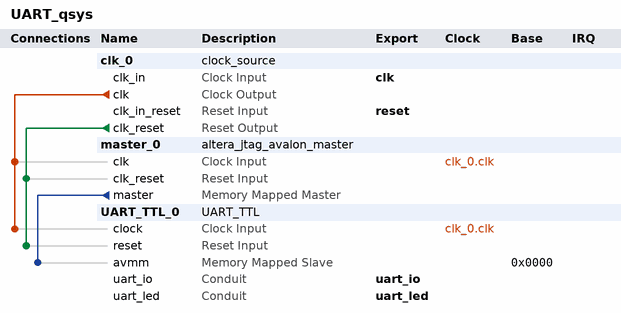
[diagram p0: system contents]
# Platform Designer (Qsys) system UART_qsys, Cyclone II EP2C8Q208C8
# Parameters at their usual value, and those the tool derives, are not listed.
package require -exact qsys 13.0
create_system UART_qsys
set_project_property DEVICE_FAMILY {Cyclone II}
set_project_property DEVICE EP2C8Q208C8

add_instance clk_0 clock_source 13.0
set_instance_parameter_value clk_0 clockFrequency 50000000

add_instance master_0 altera_jtag_avalon_master 13.0

add_instance UART_TTL_0 UART_TTL 1.1
set_instance_parameter_value UART_TTL_0 baudrate 115200
set_instance_parameter_value UART_TTL_0 dataBits 8
set_instance_parameter_value UART_TTL_0 stopBits 1

# connections
add_connection clk_0.clk master_0.clk clock
add_connection clk_0.clk UART_TTL_0.clock clock
add_connection clk_0.clk_reset master_0.clk_reset reset
add_connection clk_0.clk_reset UART_TTL_0.reset reset
add_connection master_0.master UART_TTL_0.avmm avalon
set_connection_parameter_value master_0.master/UART_TTL_0.avmm baseAddress 0x0000

# exported interfaces
add_interface clk clock sink
set_interface_property clk EXPORT_OF clk_0.clk_in
add_interface reset reset sink
set_interface_property reset EXPORT_OF clk_0.clk_in_reset
add_interface uart_io conduit end
set_interface_property uart_io EXPORT_OF UART_TTL_0.uart_io
add_interface uart_led conduit end
set_interface_property uart_led EXPORT_OF UART_TTL_0.uart_led

set_interconnect_requirement {$system} qsys_mm.clockCrossingAdapter HANDSHAKE
set_interconnect_requirement {$system} qsys_mm.maxAdditionalLatency 1

save_system UART_qsys.qsys
